# EAGLE schematic Buck (EAGLE 9.6.2)
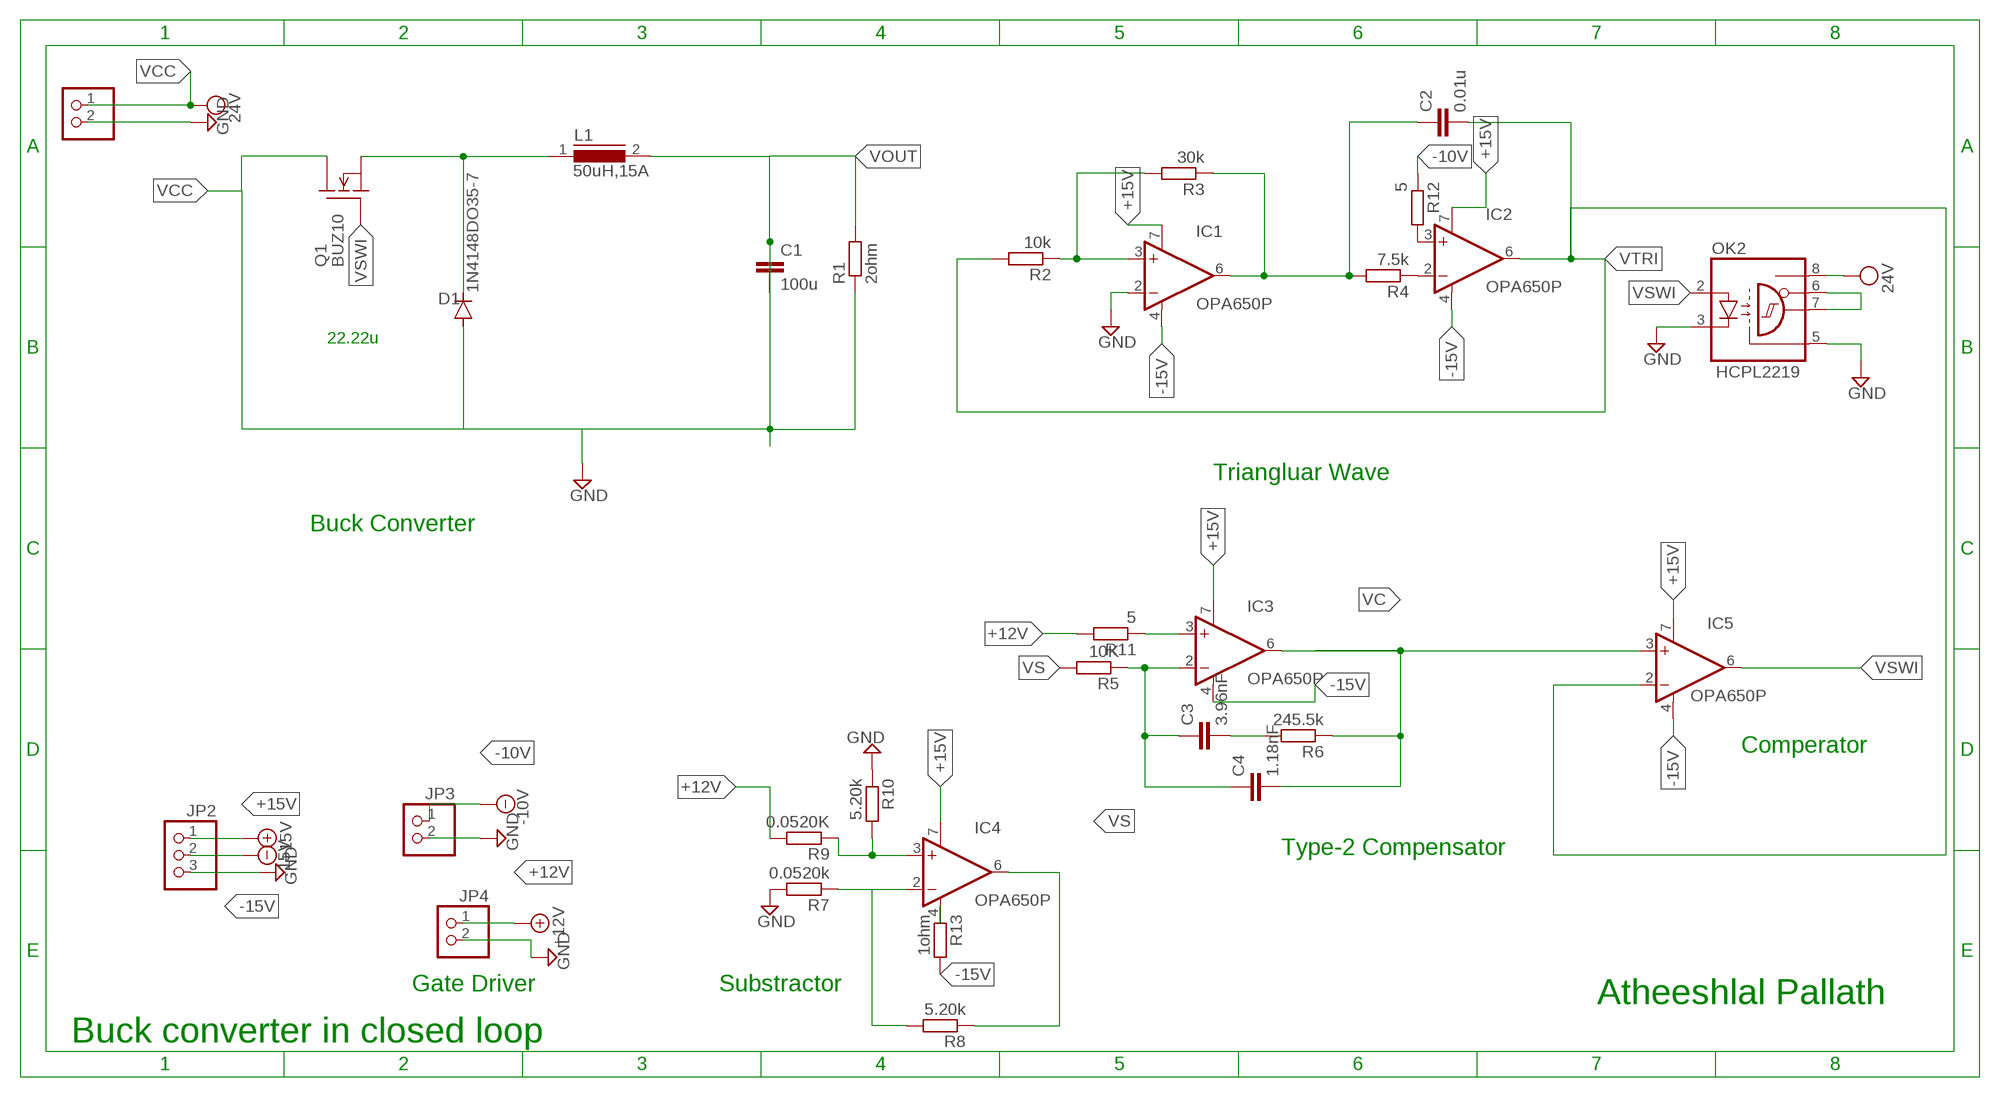
[diagram p0: schematic, sheet 1]

## Parts
C1  100u  C-EU050-050X075  [C050-050X075]
C2  0.01u  C-EU050-050X075  [C050-050X075]
C3  3.96nF  C-EU050-050X075  [C050-050X075]
C4  1.18nF  C-EU050-050X075  [C050-050X075]
D1  1N4148DO35-7  [DO35-7]
IC1  OPA650P  [DIL08]
IC2  OPA650P  [DIL08]
IC3  OPA650P  [DIL08]
IC4  OPA650P  [DIL08]
IC5  OPA650P  [DIL08]
JP1  PINHD-1X2  [1X02]
JP2  PINHD-1X3  [1X03]
JP3  PINHD-1X2  [1X02]
JP4  PINHD-1X2  [1X02]
L1  50uH,15A  DRR1,5A  [DR1,5A]
OK2  HCPL2219  [DIL08]
Q1  BUZ10  [TO220]
R1  2ohm  R-EU_0414/15  [0414/15]
R2  10k  R-EU_0414/15  [0414/15]
R3  30k  R-EU_0414/15  [0414/15]
R4  7.5k  R-EU_0414/15  [0414/15]
R5  10K  R-EU_0414/15  [0414/15]
R6  245.5k  R-EU_0414/15  [0414/15]
R7  0.0520k  R-EU_0414/15  [0414/15]
R8  5.20k  R-EU_0414/15  [0414/15]
R9  0.0520K  R-EU_0414/15  [0414/15]
R10  5.20k  R-EU_0414/15  [0414/15]
R11  5  R-EU_0414/15  [0414/15]
R12  5  R-EU_0414/15  [0414/15]
R13  1ohm  R-EU_0414/15  [0414/15]

## Nets
+12V: JP4.1
+15V: JP2.1
-10V: JP3.1
-15V: JP2.2
GND: IC1.2(-IN) JP1.2 JP2.3 JP3.2 JP4.2 OK2.3(C) OK2.5(GND) R7.2 R10.1
N$1: D1.C L1.1 Q1.3(S)
N$2: IC4.4(V-) R13.1
N$3: IC1.3(+IN) R2.1 R3.2
N$4: OK2.6(VE) OK2.7(VO)
N$5: IC2.2(-IN) R4.1
N$7: C3.1 C4.1 IC3.2(-IN) R5.1
N$8: C3.2 R6.2
N$9: C2.1 IC1.6(OUT) R3.1 R4.2
N$10: IC1.7(V+)
N$11: IC1.4(V-)
N$13: IC4.3(+IN) R9.1 R10.2
N$14: IC4.2(-IN) R7.1 R8.2
N$15: IC2.3(+IN) R12.2
N$16: IC2.7(V+)
N$17: IC3.7(V+)
N$18: IC3.4(V-)
N$20: IC4.7(V+)
N$21: IC5.7(V+)
N$22: IC5.4(V-)
N$23: IC2.4(V-)
N$24: IC3.3(+IN) R11.1
N$25: R9.2
N$26: R11.2
N$27: R12.1
VC: C4.2 IC3.6(OUT) IC5.3(+IN) R6.1
VCC: JP1.1 OK2.8(VCC) ; supply symbol labelled 24V
VOUT: C1.1 C1.2 D1.A L1.2 Q1.2(D) R1.1 R1.2
VS: IC4.6(OUT) R8.1
VSWI: IC5.6(OUT)
VTRI: C2.2 IC2.6(OUT) IC5.2(-IN) R2.2
Unconnected: OK2.2(A) Q1.1(G) R5.2 R13.2

## Notes on the sheet
- 22.22u
- Triangluar Wave
- Buck Converter
- Comperator
- Type-2 Compensator
- Gate Driver | Substractor | Atheeshlal Pallath
- Buck converter in closed loop

## Library data of the parts
C1-C4 = rcl:C-EU: CAPACITOR, European symbol; SPICEPREFIX: C
D1 = diode:1N4148: DIODE high speed (Philips)
IC1-IC5 = burr-brown:OPA650: Operational Amplifier Wideband, Low Power, Voltage Feedback; OC_FARNELL: unknown; OC_NEWARK: unknown
JP1 JP3 JP4 = pinhead:PINHD-1X2: PIN HEADER
JP2 = pinhead:PINHD-1X3: PIN HEADER
L1 = inductors:DRR1,5A: INDUCTOR; SPICEPREFIX: L
OK2 = optocoupler:HCPL2219: HEWLETT PACKARD OPTO COUPLER; MF: AGILENT TECHNOLOGIES; MPN: HCPL-2219-000E; OC_FARNELL: 9995250; OC_NEWARK: 31K6963
Q1 = transistor-fet:BUZ10: N-Channel Enhancement MOSFET 50V; 20A; 0,080Ohm
R1-R13 = rcl:R-EU_: RESISTOR, European symbol; SPICEPREFIX: R

## Net classes
0 default: width 0.203 mm, drill 0.203 mm, clearance 0.203 mm
1 VCC: width 0.965 mm, drill 0.203 mm, clearance 0.203 mm
2 +15V: width 1.219 mm, drill 0.203 mm, clearance 0.203 mm
3 GND: width 2.235 mm, drill 0.203 mm, clearance 0.203 mm
4 -15V: width 1.219 mm, drill 0.203 mm, clearance 0.203 mm
5 +12V: width 1.219 mm, drill 0.203 mm, clearance 0.203 mm
6 -10V: width 1.219 mm, drill 0.203 mm, clearance 0.203 mm